# Altium schematic sheet EEPROM I2C AT24C512.SchDoc
size 69 x 64 mm
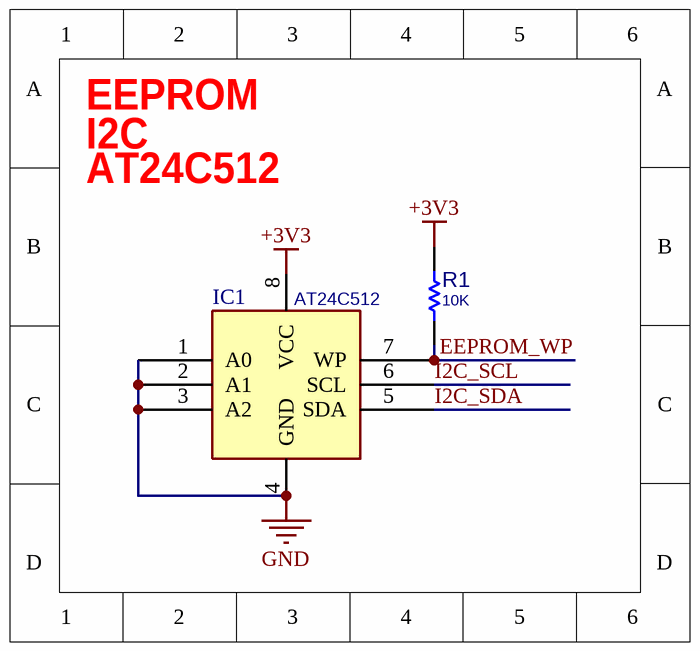
[diagram p0: EEPROM I2C AT24C512.SchDoc]

## Parts
IC1  AT24C512  [SO_8]
R1  10K  [R0603]

## Nets
+3V3: IC1.8(VCC) R1.2
GND: IC1.1(A0) IC1.2(A1) IC1.3(A2) IC1.4(GND)
EEPROM_WP: IC1.7(WP) R1.1
I2C_SCL: IC1.6(SCL)
I2C_SDA: IC1.5(SDA)

## Notes on the sheet
- I2C
- EEPROM
- AT24C512

## Library data of the parts
IC1 = EEPROM_I2C_AT24C512_SOP8: EEPROM, I2C, 64KB; Value: AT24C512
R1 = RES_SMD: RESISTOR, SMD; MANF_P#: RK73H1ETTP4701F; MANF: KOA SPEER; PARAM: 0.063W; DESC: DESCRIPTION; DIST#: MOUSER; PARAM2: 1%; ASSEMBLY: ASSEMBLY; PRICE: 100= 0.5$; VALUE: 10K